# EasyEDA Pro project ProDoc_HackerCard_2025-08-16.epro

# Schematic Schematic1
Board Name: Board1; Create Date: 2025-08-16; Page Name: P1; Project Name: PCB_PCB_HackerCard_2025-08-16; Schematic Name: Schematic1; Update Date: 2025-08-16; Company: EasyEDA.com; Page Size: A4; Version: V1.0
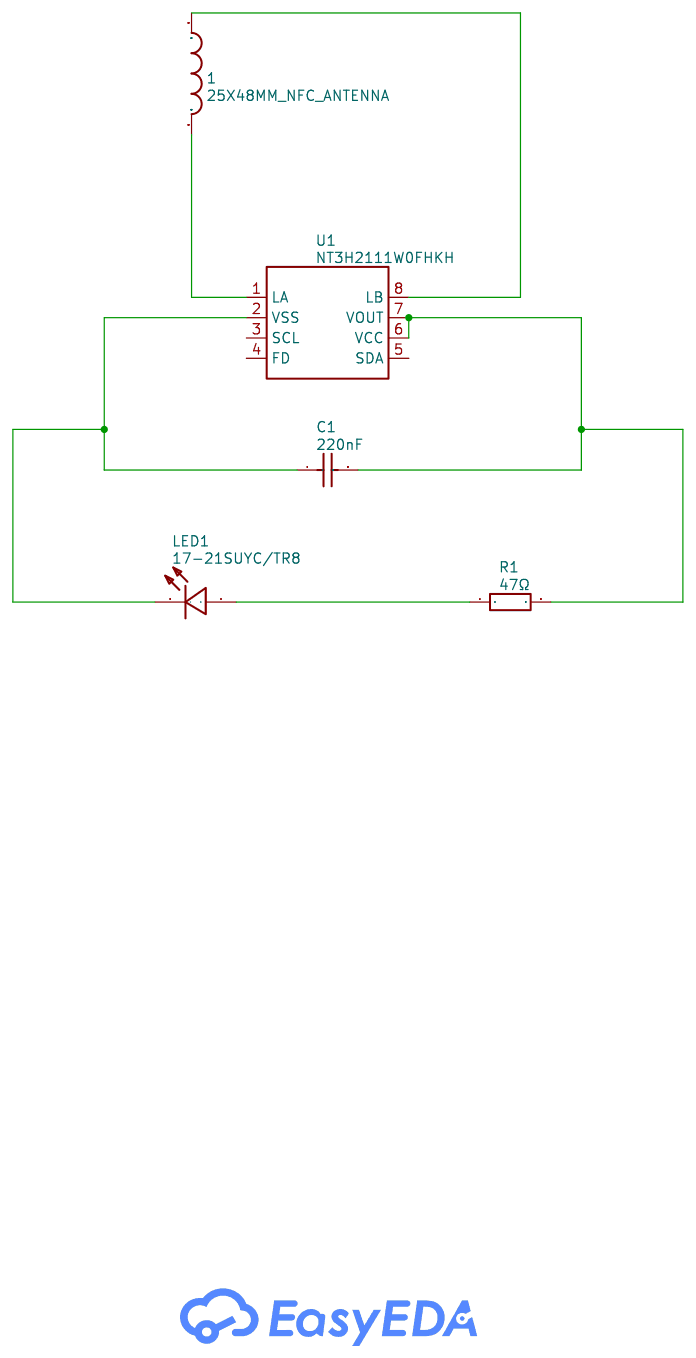
[diagram p0: schematic sheet]

## Parts
1  25X48MM_NFC_ANTENNA  [25X48MM_NFC_ANTENNA]
C1  220nF  [C0603]
LED1  17-21SUYC/TR8  [LED0805-R-RD]
R1  47Ω  [R0603]
U1  NT3H2111W0FHKH  [XQFN-8_L1.6-W1.6-P0.50-BL_NT3H2111W0FHKH]

## Library data of the parts
1 = 25X48MM_NFC_ANTENNA: Contributor: dnonoo; spicePre: ?
C1 = 220nF: Supplier: LCSC; Manufacturer Part: CL10B224KA8NNNC; Manufacturer: SAMSUNG(三星); Supplier Part: C21120; JLCPCB Part Class: Basic Part; nameAlias: Value; spicePre: C; spiceSymbolName: CL10B224KA8NNNC
LED1 = 17-21SUYC/TR8: Supplier: LCSC; Manufacturer: KENTO; Manufacturer Part: KT-0805黄灯; Supplier Part: C2296; JLCPCB Part Class: Basic Part; spicePre: L
R1 = 47Ω: Supplier: LCSC; Manufacturer: UNI-ROYAL(厚声); Manufacturer Part: 0603WAF470JT5E; Supplier Part: C23182; JLCPCB Part Class: Basic Part; nameAlias: Value; spicePre: R; spiceSymbolName: 0603WAF470JT5E
U1 = NT3H2111W0FHKH: Supplier: LCSC; Supplier Part: C710403; Manufacturer: NXP(恩智浦); JLCPCB Part Class: Extended Part; Contributor: LCSC; spicePre: U

## Nets
$1N218: 1.P$2 U1.1(LA)
$1N219: 1.P$1 U1.8(LB)
$1N220: C1.1 LED1.2(-) U1.2(VSS)
$1N221: C1.2 R1.2 U1.6(VCC) U1.7(VOUT)
$1N222: LED1.1(+) R1.1

Not connected (* = marked no-connect by the designer): U1 3(SCL) 4(FD) 5(SDA)

# Board PCB1
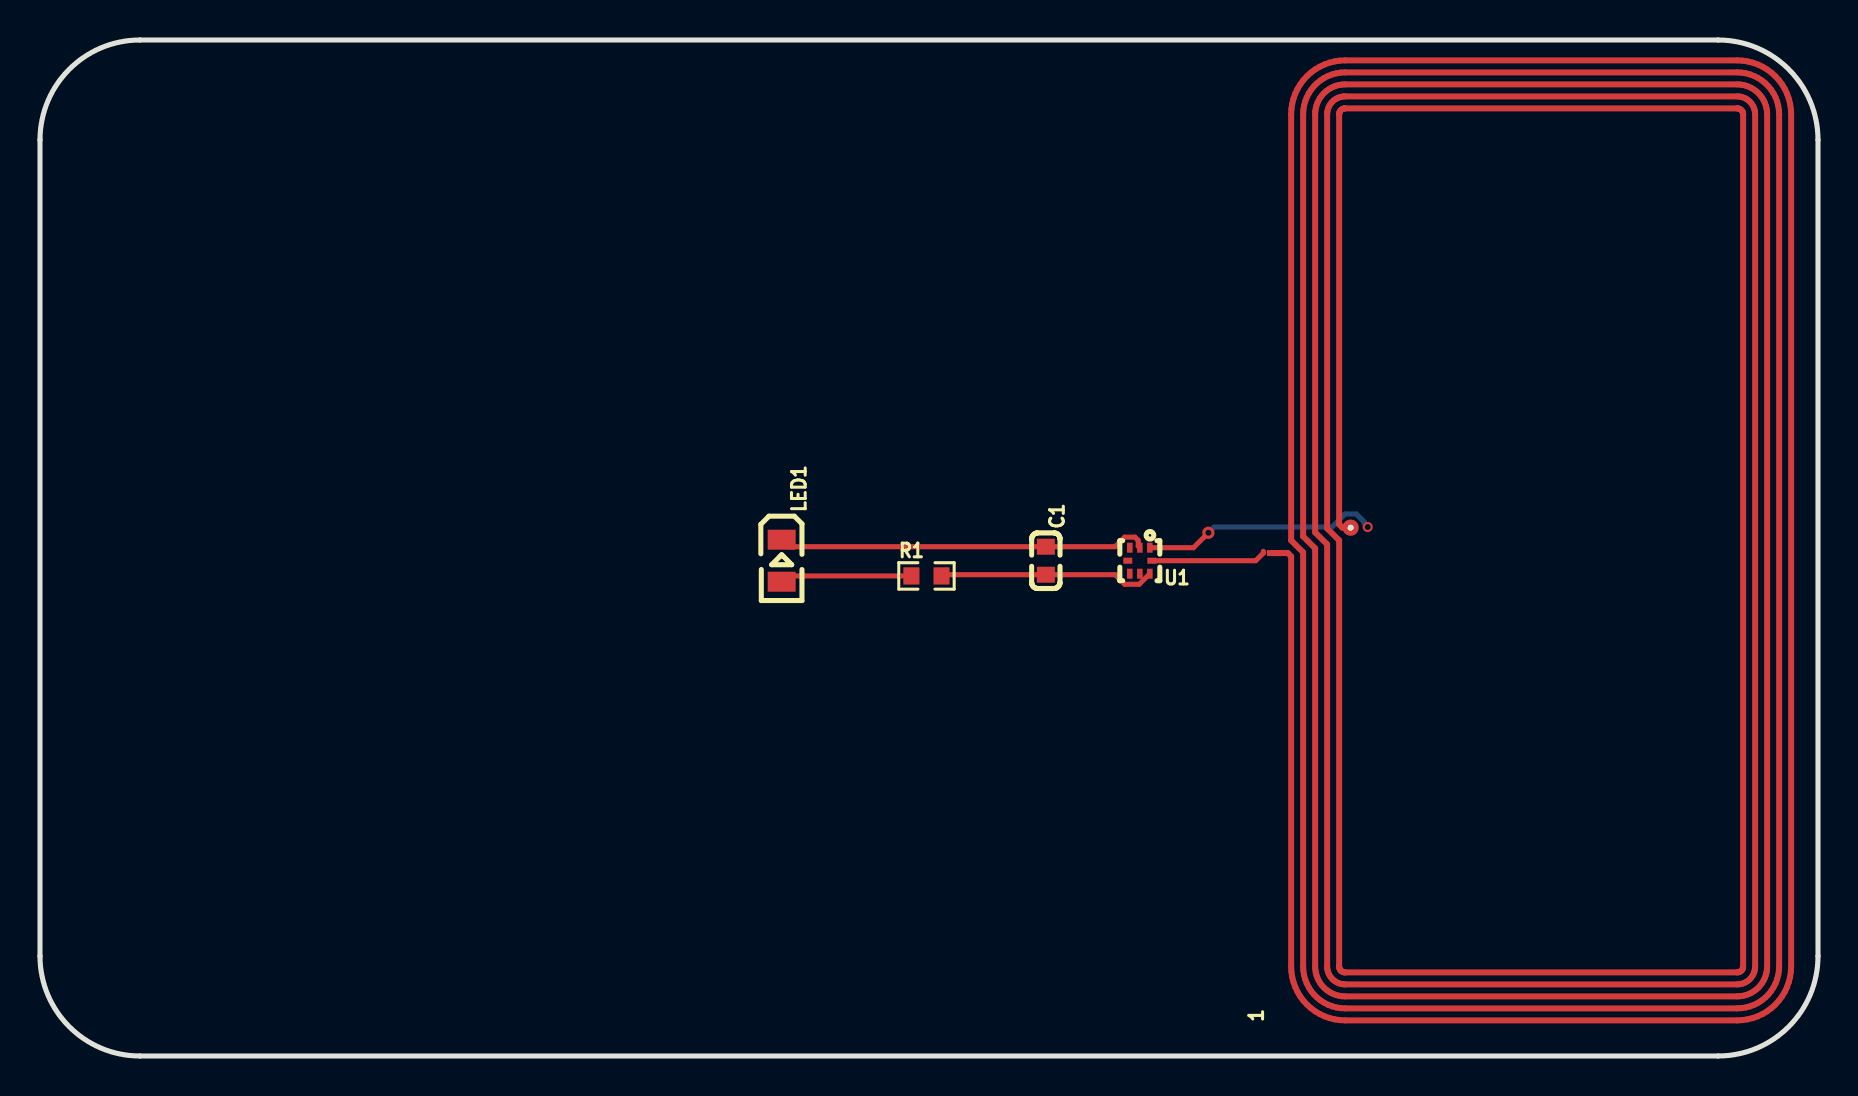
[diagram p1: board, top side]
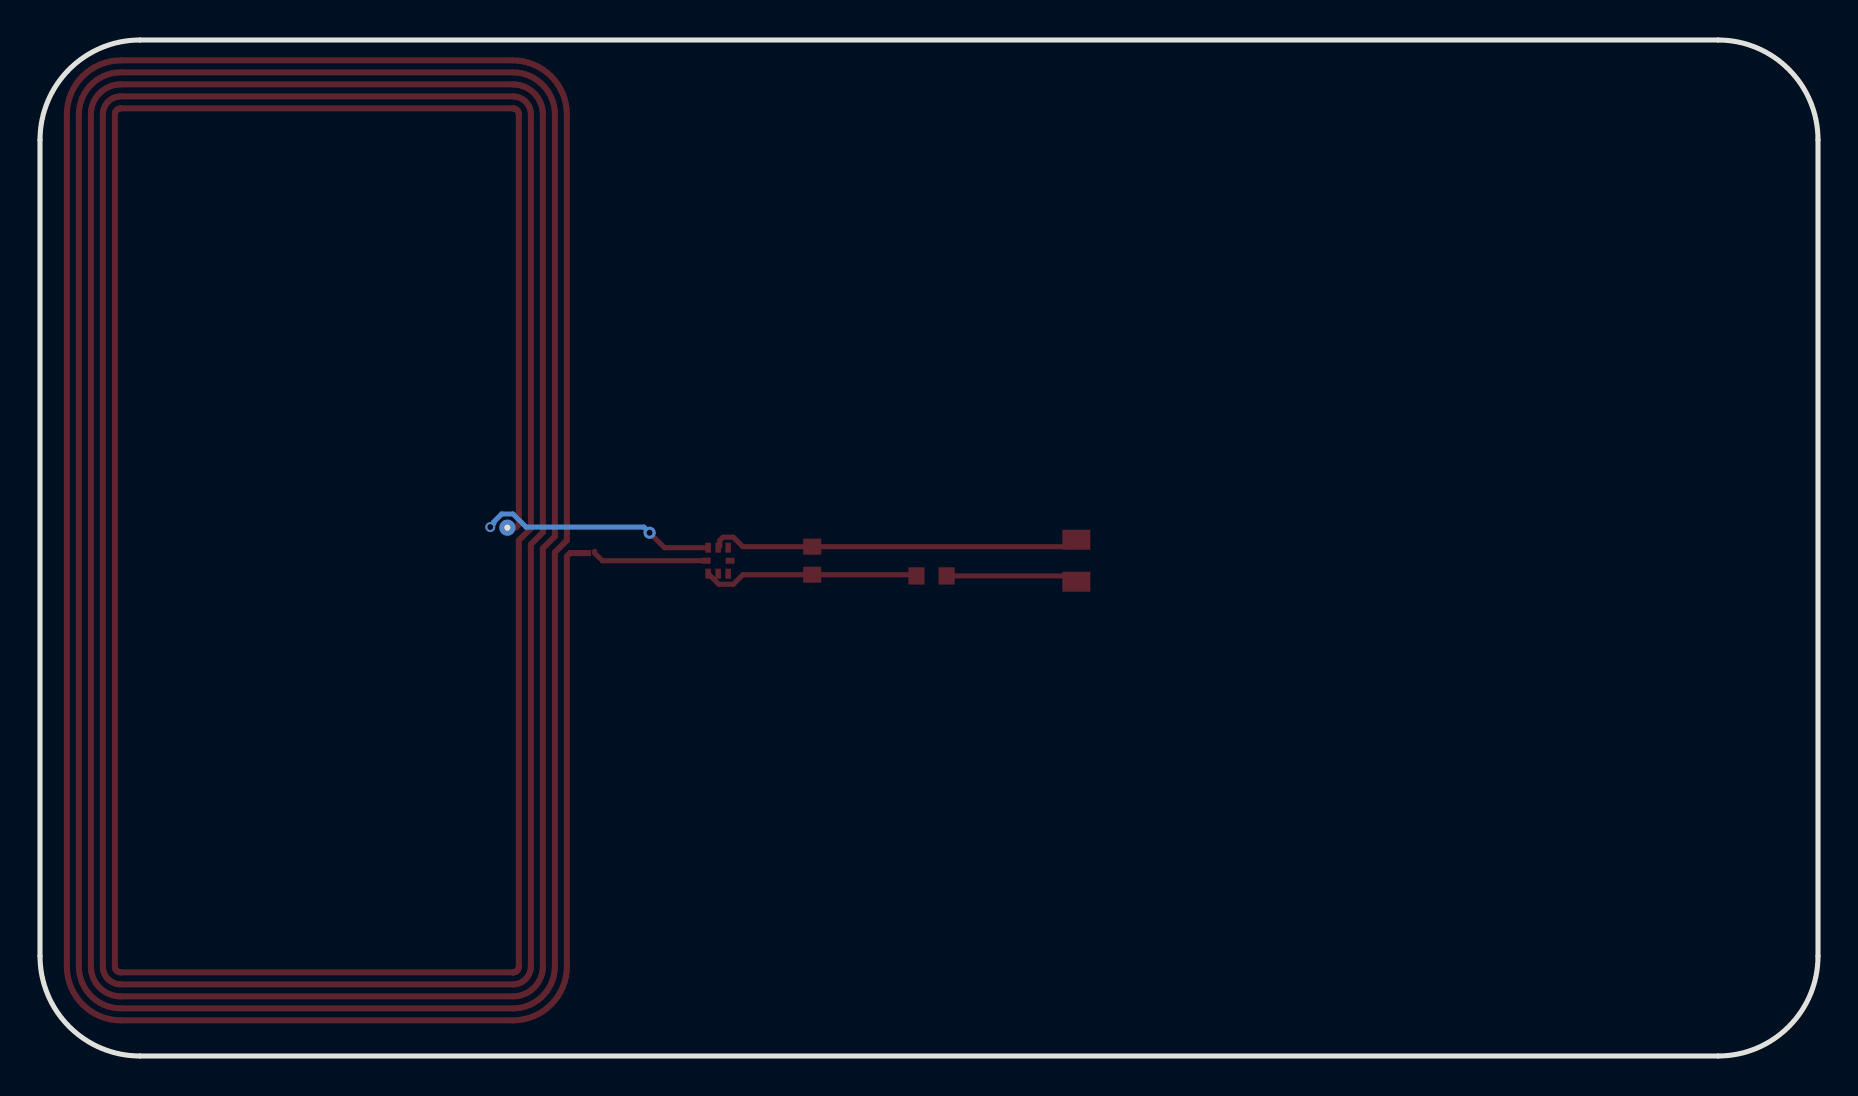
[diagram p2: board, bottom side, seen from below]

Outline 88.9 x 50.8 mm; copper layers: Top Layer, Bottom Layer. Coordinates in mm from the lower left corner of the outline.
Outline path: 0,45.8 arc(1.46,49.34) 5,50.8 83.9,50.8 arc(87.44,49.34) 88.9,45.8 88.9,5 arc(87.44,1.46) 83.9,0 5,0 arc(1.46,1.46) 0,5 0,45.8
Stack: Top Layer 0.035mm / Dielectric1 1.51mm FR4 er 4.5 / Bottom Layer 0.035mm

## Design rules (mm)
template: JLCPCB Capability(Two Layers Board)
spacing copperThickness1oz (default): track to track 0.102, other pairs 0.152 to 0.3
spacing copperThickness2oz: track to track 0.203, other pairs 0.152 to 0.3
track width copperThickness1oz (default): min 0.127, default 0.254, max 2.54
track width copperThickness2oz: min 0.203, default 0.254, max 2.54
differential pair differentialPair (default): width min 0.127, default 0.254, max 2.54; gap min 0.152, default 0.152
via viaSize (default): diameter min 0.5, default 0.61, max 10; hole min 0.3, default 0.305, max 6.3

## Placement (name value [footprint] x y rotation side)
1  -  [25X48MM_NFC_ANTENNA]  75.06 25.78 90 top
C1  220nF  [C0603]  50.29 24.77 270 top
LED1  17-21SUYC/TR8  [LED0805-R-RD]  37.08 24.77 270 top
R1  47Ω  [R0603]  44.32 24 0 top
U1  NT3H2111W0FHKH  [XQFN-8_L1.6-W1.6-P0.50-BL_NT3H2111W0FHKH]  54.99 24.77 180 top

## Footprints (pads in the part's own frame, mm; a bottom-side part is the same pattern mirrored in y, then rotated)
25X48MM_NFC_ANTENNA
  rect 0.3x0.75 smd: P$1(-0.635,13.335)
  round 0.808 hole 0.3x0.3: P$2(0.635,9.525)
C0603
  rect 0.8x0.9 smd: 1(-0.7,0) 2(0.7,0)
LED0805-R-RD
  rect 1x1.399 smd: 1(1.05,0) 2(-1.05,0)
R0603
  rect 0.806x0.864 smd: 1(-0.753,0) 2(0.753,0)
XQFN-8_L1.6-W1.6-P0.50-BL_NT3H2111W0FHKH
  rect 0.28x0.5 smd: 1(-0.5,-0.65) 2(0,-0.65) 3(0.5,-0.65) 5(0.5,0.65) 6(0,0.65) 7(-0.5,0.65)
  rect 0.45x0.3 smd: 4(0.6,0) 8(-0.6,0)

## Nets
As in the schematic.

Pads without a net: U1 3 4 5

## Via types
v1: diameter 0.61, hole 0.305, Top Layer to Bottom Layer, 1 via
v2: diameter 0.5, hole 0.3, Top Layer to Bottom Layer, 1 via

## Routing (per net, layer and track width the routed paths; a pad name or vN(x,y) marks a point on that pad's centre or on a via; arc(x,y) is an arc through that point)
$1N218: length 11.9
  Top Layer w0.254: U1.1 57.67,25.42 v1(58.42,26.16)
  Bottom Layer w0.254: v1(58.42,26.16) 58.71,26.45 64.6,26.45 65.25,27.1 65.81,27.1 66.22,26.7 66.22,26.62 v2(66.39,26.45)
$1N219: length 5.8
  Top Layer w0.254: 61.17,25.23 61.17,25.15 60.78,24.77 U1.8
$1N220: length 18.6
  Top Layer w0.254: U1.2 54.91,25.5 54.91,25.78 54.75,25.94 54.24,25.94 53.76,25.47 C1.1 37.43,25.47 LED1.2
$1N221: length 10.9
  Top Layer w0.254: R1.2 45.14,24.07 C1.2 53.76,24.07 54.24,23.59 54.96,23.59 U1.7
$1N222: length 6.6
  Top Layer w0.254: LED1.1 37.37,24 R1.1
